# EAGLE design remote-connection-board-v2 (EAGLE 6.4)
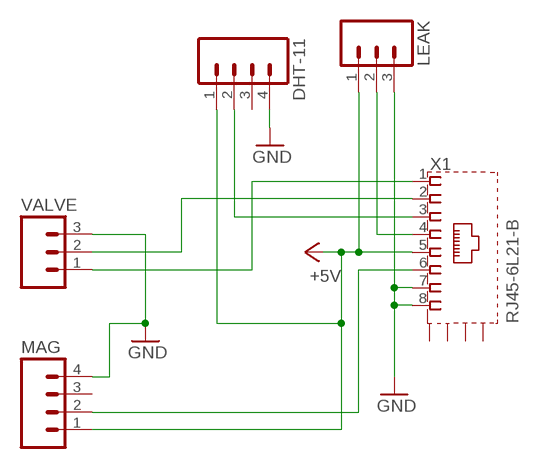
[diagram p0: schematic, sheet 1]

## Parts
DHT-11  M04  [04P]
LEAK  M03  [03P]
MAG  M04  [04P]
VALVE  M03  [03P]
X1  RJ45-6L21-B  [RJ45-SHIELD1]

## Nets
+5V: DHT-11.1 LEAK.1 MAG.1 X1.5
GND: DHT-11.4 LEAK.3 MAG.4 VALVE.3 X1.7 X1.8
N$1: VALVE.2 X1.2
N$2: VALVE.1 X1.1
N$3: MAG.2 X1.6
N$5: DHT-11.2 X1.3
N$6: LEAK.2 X1.4
Unconnected: DHT-11.3 MAG.3 X1.S1(S) X1.S2(S) X1.S3(S) X1.S4(S)

## Library data of the parts
DHT-11 MAG = con-amp-quick:M04: AMP QUICK CONNECTOR; OC_FARNELL: unknown; OC_NEWARK: unknown
LEAK VALVE = con-amp-quick:M03: AMP QUICK CONNECTOR; OC_FARNELL: unknown; OC_NEWARK: unknown
X1 = con-tycoelectronics:RJ45*2: RJ45 Low Profile Shield Type 2 For all RJ45 L, LC, LCT and X Series Models Source: www.tycoelectronics.com .. ENG_DS_1654001_1099_RJ_L_0507.pdf; OC_FARNELL: unknown; OC_NEWARK: unknown

## Board
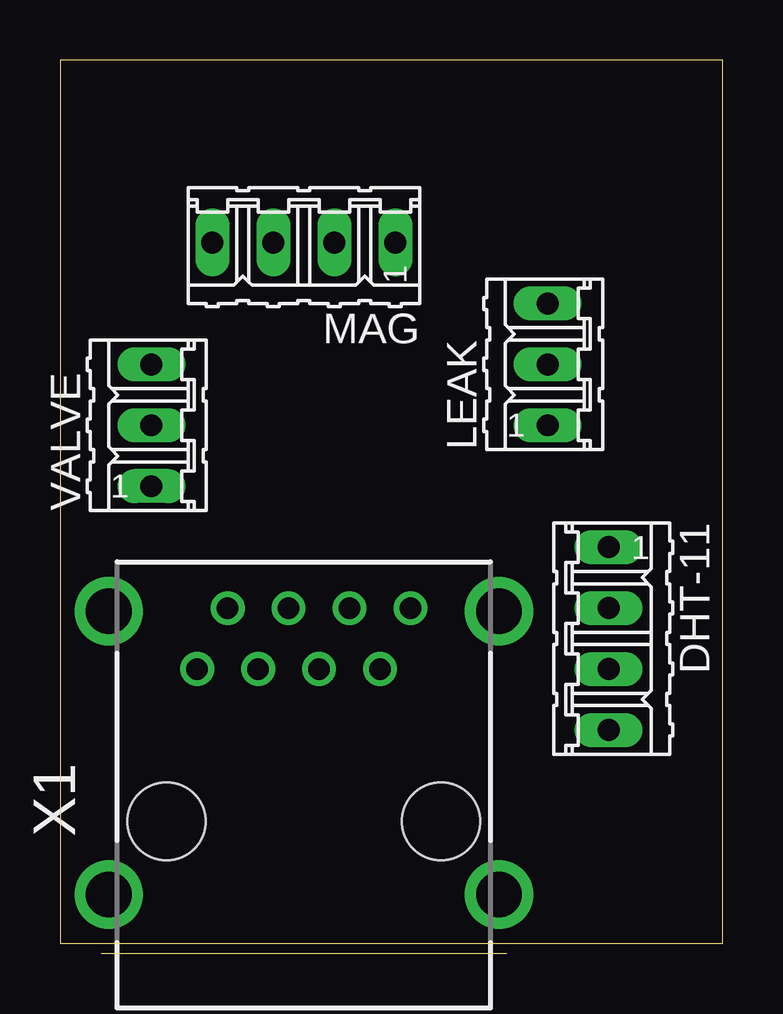
[diagram p1: board, top side]
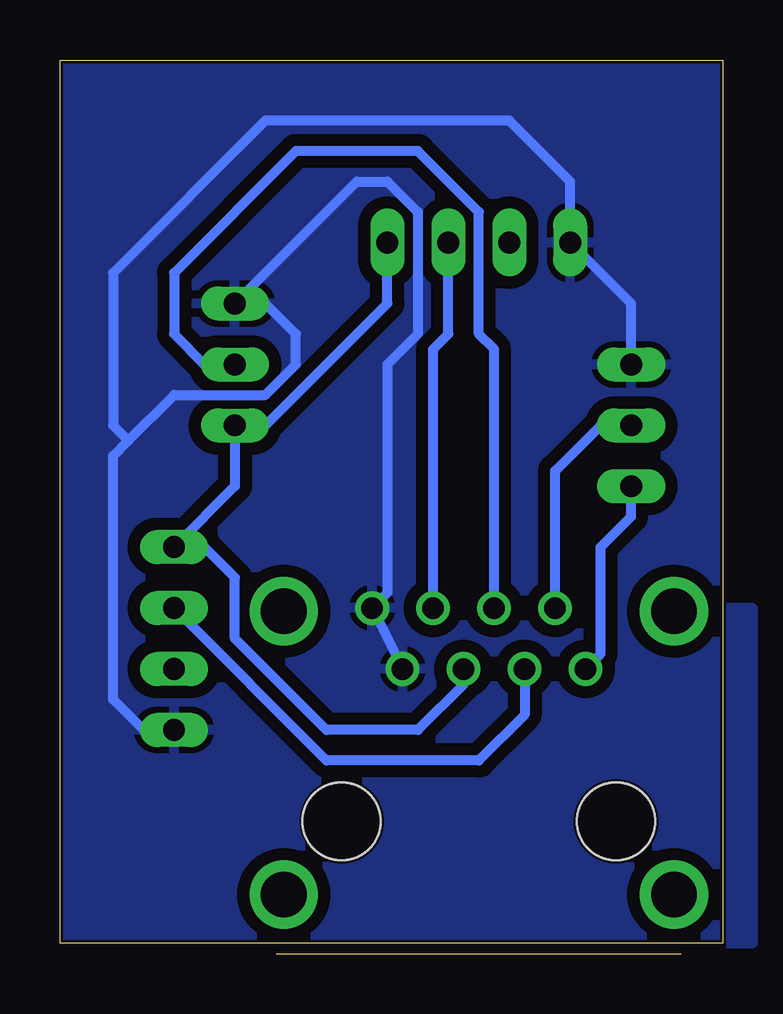
[diagram p2: board, bottom side, seen from below]

Size 27.61 x 36.82 mm. Coordinates in mm from the lower left corner, seen from the top.
Outline: 0,0 27.61,0 27.61,36.82 0,36.82 0,0
Copper layers (1*16): Top 0.035mm / dielectric 1.5mm / Bottom 0.035mm
Design rules "default *": minimum track width 10mil, minimum drill 24mil, track to track 20mil, track to pad 20mil, pad to pad 20mil, via to via 20mil, smd to smd 20mil, copper to edge 5mil, drill to drill 8mil, minimum pad ring 10mil, minimum via ring 8mil, stop-mask expansion 4mil, vias tented up to drill 0mil, thermal gap 10mil

### Footprints (pad centres in the part's own frame; a part is rotated, then mirrored left to right if it is on the bottom)
04P = drill 0.914 long: 1 -3.81,0; 2 -1.27,0; 3 1.27,0; 4 3.81,0
03P = drill 0.914 long: 1 -2.54,0; 2 0,0; 3 2.54,0
RJ45-SHIELD1 = drill 0.9 pad 1.4: 1 -4.445,6.35; 2 -3.175,8.89; 3 -1.905,6.35; 4 -0.635,8.89; 5 0.635,6.35; 6 1.905,8.89; 7 3.175,6.35; 8 4.445,8.89 | drill 1.9 pad 2.5: S1 -8.128,-3.048; S2 8.128,-3.048; S3 -8.128,8.76; S4 8.128,8.76 | hole 3.251: -5.715,0; 5.715,0

### Placement (x,y rotation side)
DHT-11  22.86,12.7 270 top
LEAK  20.32,24.13 90 top
MAG  10.16,29.21 180 top
VALVE  3.81,21.59 90 top
X1  10.16,5.08 0 top

### Tracks (layer width: path | path; a pad name or v marks a point on that pad's centre or on a via)
+5V
  Bottom 0.406: X1.5 10.79,10.79 12.7,8.89 16.51,8.89 20.32,12.7 20.32,15.24 21.59,16.51 DHT-11.1 20.32,19.05 LEAK.1 19.05,21.59 13.97,26.67 MAG.1
GND
  Bottom 0.406: VALVE.3 3.81,26.67 MAG.4 6.35,31.75 8.89,34.29 19.05,34.29 25.4,27.94 25.4,21.59 24.77,20.95 | X1.7 X1.8 13.97,14.61 13.97,24.13 12.7,25.4 12.7,30.48 13.97,31.75 15.24,31.75 LEAK.3 19.05,26.67 17.78,25.4 17.78,24.13 19.05,22.86 22.86,22.86 24.77,20.95 | DHT-11.4 24.13,8.89 25.4,10.16 25.4,20.32 24.77,20.95
  pour Bottom: 0,36.83 0,0 27.94,0 27.94,36.83
N$1
  Bottom 0.406: X1.2 6.99,19.68 5.08,21.59 VALVE.2
N$2
  Bottom 0.406: X1.1 5.08,12.06 5.08,16.51 3.81,17.78 VALVE.1
N$3
  Bottom 0.406: X1.6 12.06,24.77 11.43,25.4 MAG.2
N$4
  pour Bottom: -1.27,13.97 10.16,13.97 19.05,13.97 19.05,0 -1.27,0
N$5
  Bottom 0.406: X1.3 8.26,9.53 10.16,7.62 16.51,7.62 DHT-11.2
N$6
  Bottom 0.406: X1.4 9.53,24.77 10.16,25.4 10.16,30.48 12.7,33.02 17.78,33.02 22.86,27.94 22.86,25.4 21.59,24.13 LEAK.2